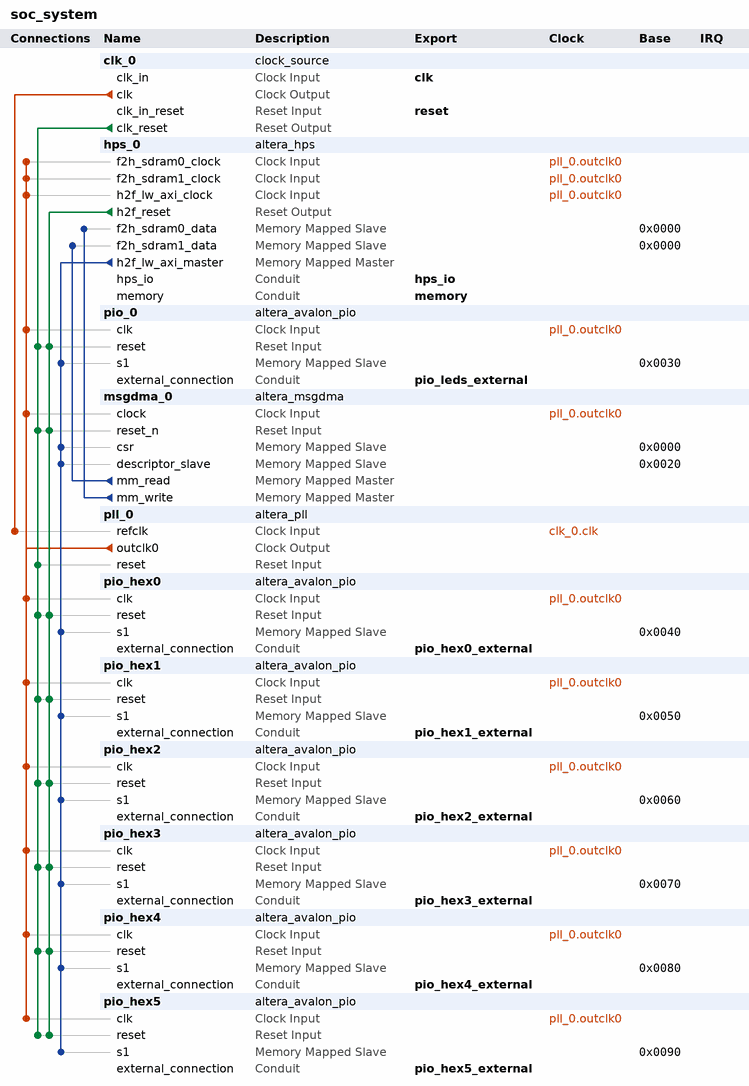
[diagram p0: system contents]
# Platform Designer (Qsys) system soc_system, Cyclone V 5CSXFC6D6F31C6
# Parameters at their usual value, and those the tool derives, are not listed.
package require -exact qsys 18.1
create_system soc_system
set_project_property DEVICE_FAMILY {Cyclone V}
set_project_property DEVICE 5CSXFC6D6F31C6

add_instance clk_0 clock_source 18.1
set_instance_parameter_value clk_0 clockFrequency 50000000

add_instance hps_0 altera_hps 18.1
set_instance_parameter_value hps_0 EMAC1_Mode RGMII
set_instance_parameter_value hps_0 EMAC1_PinMuxing {HPS I/O Set 0}
set_instance_parameter_value hps_0 F2SCLK_COLDRST_Enable false
set_instance_parameter_value hps_0 F2SCLK_DBGRST_Enable false
set_instance_parameter_value hps_0 F2SCLK_WARMRST_Enable false
set_instance_parameter_value hps_0 F2SDRAM_Type {Avalon-MM Write-Only,Avalon-MM Read-Only}
set_instance_parameter_value hps_0 F2SDRAM_Width 256,256
set_instance_parameter_value hps_0 F2SINTERRUPT_Enable false
set_instance_parameter_value hps_0 F2S_Width 0
set_instance_parameter_value hps_0 FPGA_PERIPHERAL_OUTPUT_CLOCK_FREQ_EMAC0_GTX_CLK 125
set_instance_parameter_value hps_0 FPGA_PERIPHERAL_OUTPUT_CLOCK_FREQ_EMAC0_MD_CLK 2.5
set_instance_parameter_value hps_0 FPGA_PERIPHERAL_OUTPUT_CLOCK_FREQ_EMAC1_GTX_CLK 125
set_instance_parameter_value hps_0 FPGA_PERIPHERAL_OUTPUT_CLOCK_FREQ_EMAC1_MD_CLK 2.5
set_instance_parameter_value hps_0 HPS_PROTOCOL DDR3
set_instance_parameter_value hps_0 I2C0_Mode I2C
set_instance_parameter_value hps_0 I2C0_PinMuxing {HPS I/O Set 0}
set_instance_parameter_value hps_0 I2C1_Mode I2C
set_instance_parameter_value hps_0 I2C1_PinMuxing {HPS I/O Set 0}
set_instance_parameter_value hps_0 LWH2F_Enable true
set_instance_parameter_value hps_0 MEM_BANKADDR_WIDTH 3
set_instance_parameter_value hps_0 MEM_CLK_FREQ 400.0
set_instance_parameter_value hps_0 MEM_COL_ADDR_WIDTH 10
set_instance_parameter_value hps_0 MEM_DQ_WIDTH 32
set_instance_parameter_value hps_0 MEM_DRV_STR RZQ/6
set_instance_parameter_value hps_0 MEM_ROW_ADDR_WIDTH 15
set_instance_parameter_value hps_0 MEM_RTT_NOM RZQ/6
set_instance_parameter_value hps_0 MEM_RTT_WR {Dynamic ODT off}
set_instance_parameter_value hps_0 MEM_TCL 11
set_instance_parameter_value hps_0 MEM_TFAW_NS 45.0
set_instance_parameter_value hps_0 MEM_TRAS_NS 35.0
set_instance_parameter_value hps_0 MEM_TRCD_NS 13.75
set_instance_parameter_value hps_0 MEM_TRFC_NS 260.0
set_instance_parameter_value hps_0 MEM_TRP_NS 13.75
set_instance_parameter_value hps_0 MEM_VENDOR Micron
set_instance_parameter_value hps_0 MEM_WTCL 7
set_instance_parameter_value hps_0 QSPI_Mode {1 SS}
set_instance_parameter_value hps_0 QSPI_PinMuxing {HPS I/O Set 0}
set_instance_parameter_value hps_0 REF_CLK_FREQ 25.0
set_instance_parameter_value hps_0 S2FCLK_USER2CLK 5
set_instance_parameter_value hps_0 S2F_Width 0
set_instance_parameter_value hps_0 SDIO_Mode {4-bit Data}
set_instance_parameter_value hps_0 SDIO_PinMuxing {HPS I/O Set 0}
set_instance_parameter_value hps_0 SPIM1_Mode {Single Slave Select}
set_instance_parameter_value hps_0 SPIM1_PinMuxing {HPS I/O Set 0}
set_instance_parameter_value hps_0 STM_Enable false
set_instance_parameter_value hps_0 TIMING_BOARD_AC_SKEW 0.02
set_instance_parameter_value hps_0 TIMING_BOARD_AC_TO_CK_SKEW 0.01
set_instance_parameter_value hps_0 TIMING_BOARD_DQ_TO_DQS_SKEW 0.05
set_instance_parameter_value hps_0 TIMING_BOARD_MAX_CK_DELAY 0.03
set_instance_parameter_value hps_0 TIMING_BOARD_MAX_DQS_DELAY 0.02
set_instance_parameter_value hps_0 TIMING_BOARD_SKEW_BETWEEN_DQS 0.06
set_instance_parameter_value hps_0 TIMING_BOARD_SKEW_CKDQS_DIMM_MAX 0.12
set_instance_parameter_value hps_0 TIMING_BOARD_SKEW_CKDQS_DIMM_MIN 0.06
set_instance_parameter_value hps_0 TIMING_BOARD_SKEW_WITHIN_DQS 0.01
set_instance_parameter_value hps_0 TIMING_TDH 65
set_instance_parameter_value hps_0 TIMING_TDQSCK 255
set_instance_parameter_value hps_0 TIMING_TDQSQ 125
set_instance_parameter_value hps_0 TIMING_TDS 30
set_instance_parameter_value hps_0 TIMING_TIH 140
set_instance_parameter_value hps_0 TIMING_TIS 190
set_instance_parameter_value hps_0 TIMING_TQSH 0.4
set_instance_parameter_value hps_0 UART0_Mode {No Flow Control}
set_instance_parameter_value hps_0 UART0_PinMuxing {HPS I/O Set 0}
set_instance_parameter_value hps_0 USB1_Mode SDR
set_instance_parameter_value hps_0 USB1_PinMuxing {HPS I/O Set 0}
set_instance_parameter_value hps_0 desired_cfg_clk_mhz 100.0
set_instance_parameter_value hps_0 desired_qspi_clk_mhz 400.0

add_instance pio_0 altera_avalon_pio 18.1
set_instance_parameter_value pio_0 direction Output
set_instance_parameter_value pio_0 resetValue 170
set_instance_parameter_value pio_0 width 10

add_instance msgdma_0 altera_msgdma 18.1
set_instance_parameter_value msgdma_0 BURST_ENABLE 1
set_instance_parameter_value msgdma_0 DATA_FIFO_DEPTH 1024
set_instance_parameter_value msgdma_0 DATA_WIDTH 256
set_instance_parameter_value msgdma_0 DESCRIPTOR_FIFO_DEPTH 128
set_instance_parameter_value msgdma_0 ENHANCED_FEATURES 0
set_instance_parameter_value msgdma_0 ERROR_ENABLE 0
set_instance_parameter_value msgdma_0 MAX_BURST_COUNT 16
set_instance_parameter_value msgdma_0 MAX_BYTE 368435456
set_instance_parameter_value msgdma_0 MODE 0
set_instance_parameter_value msgdma_0 PACKET_ENABLE 0
set_instance_parameter_value msgdma_0 TRANSFER_TYPE {Aligned Accesses}

add_instance pll_0 altera_pll 18.1
set_instance_parameter_value pll_0 gui_device_speed_grade 1
set_instance_parameter_value pll_0 gui_number_of_clocks 1
set_instance_parameter_value pll_0 gui_operation_mode normal
set_instance_parameter_value pll_0 gui_output_clock_frequency0 100.0
set_instance_parameter_value pll_0 gui_pll_mode {Integer-N PLL}
set_instance_parameter_value pll_0 gui_reference_clock_frequency 50.0
set_instance_parameter_value pll_0 gui_use_locked false

add_instance pio_hex0 altera_avalon_pio 18.1
set_instance_parameter_value pio_hex0 direction Output
set_instance_parameter_value pio_hex0 resetValue 127
set_instance_parameter_value pio_hex0 width 7

add_instance pio_hex1 altera_avalon_pio 18.1
set_instance_parameter_value pio_hex1 direction Output
set_instance_parameter_value pio_hex1 resetValue 127
set_instance_parameter_value pio_hex1 width 7

add_instance pio_hex2 altera_avalon_pio 18.1
set_instance_parameter_value pio_hex2 direction Output
set_instance_parameter_value pio_hex2 resetValue 127
set_instance_parameter_value pio_hex2 width 7

add_instance pio_hex3 altera_avalon_pio 18.1
set_instance_parameter_value pio_hex3 direction Output
set_instance_parameter_value pio_hex3 resetValue 127
set_instance_parameter_value pio_hex3 width 7

add_instance pio_hex4 altera_avalon_pio 18.1
set_instance_parameter_value pio_hex4 direction Output
set_instance_parameter_value pio_hex4 resetValue 127
set_instance_parameter_value pio_hex4 width 7

add_instance pio_hex5 altera_avalon_pio 18.1
set_instance_parameter_value pio_hex5 direction Output
set_instance_parameter_value pio_hex5 resetValue 127
set_instance_parameter_value pio_hex5 width 7

# connections
add_connection clk_0.clk pll_0.refclk clock
add_connection pll_0.outclk0 hps_0.f2h_sdram0_clock clock
add_connection pll_0.outclk0 hps_0.f2h_sdram1_clock clock
add_connection pll_0.outclk0 hps_0.h2f_lw_axi_clock clock
add_connection pll_0.outclk0 msgdma_0.clock clock
add_connection pll_0.outclk0 pio_0.clk clock
add_connection pll_0.outclk0 pio_hex0.clk clock
add_connection pll_0.outclk0 pio_hex1.clk clock
add_connection pll_0.outclk0 pio_hex2.clk clock
add_connection pll_0.outclk0 pio_hex3.clk clock
add_connection pll_0.outclk0 pio_hex4.clk clock
add_connection pll_0.outclk0 pio_hex5.clk clock
add_connection clk_0.clk_reset msgdma_0.reset_n reset
add_connection clk_0.clk_reset pio_0.reset reset
add_connection clk_0.clk_reset pio_hex0.reset reset
add_connection clk_0.clk_reset pio_hex1.reset reset
add_connection clk_0.clk_reset pio_hex2.reset reset
add_connection clk_0.clk_reset pio_hex3.reset reset
add_connection clk_0.clk_reset pio_hex4.reset reset
add_connection clk_0.clk_reset pio_hex5.reset reset
add_connection clk_0.clk_reset pll_0.reset reset
add_connection hps_0.h2f_reset msgdma_0.reset_n reset
add_connection hps_0.h2f_reset pio_0.reset reset
add_connection hps_0.h2f_reset pio_hex0.reset reset
add_connection hps_0.h2f_reset pio_hex1.reset reset
add_connection hps_0.h2f_reset pio_hex2.reset reset
add_connection hps_0.h2f_reset pio_hex3.reset reset
add_connection hps_0.h2f_reset pio_hex4.reset reset
add_connection hps_0.h2f_reset pio_hex5.reset reset
add_connection hps_0.h2f_lw_axi_master msgdma_0.csr avalon
set_connection_parameter_value hps_0.h2f_lw_axi_master/msgdma_0.csr baseAddress 0x0000
add_connection hps_0.h2f_lw_axi_master msgdma_0.descriptor_slave avalon
set_connection_parameter_value hps_0.h2f_lw_axi_master/msgdma_0.descriptor_slave baseAddress 0x0020
add_connection hps_0.h2f_lw_axi_master pio_0.s1 avalon
set_connection_parameter_value hps_0.h2f_lw_axi_master/pio_0.s1 baseAddress 0x0030
add_connection hps_0.h2f_lw_axi_master pio_hex0.s1 avalon
set_connection_parameter_value hps_0.h2f_lw_axi_master/pio_hex0.s1 baseAddress 0x0040
add_connection hps_0.h2f_lw_axi_master pio_hex1.s1 avalon
set_connection_parameter_value hps_0.h2f_lw_axi_master/pio_hex1.s1 baseAddress 0x0050
add_connection hps_0.h2f_lw_axi_master pio_hex2.s1 avalon
set_connection_parameter_value hps_0.h2f_lw_axi_master/pio_hex2.s1 baseAddress 0x0060
add_connection hps_0.h2f_lw_axi_master pio_hex3.s1 avalon
set_connection_parameter_value hps_0.h2f_lw_axi_master/pio_hex3.s1 baseAddress 0x0070
add_connection hps_0.h2f_lw_axi_master pio_hex4.s1 avalon
set_connection_parameter_value hps_0.h2f_lw_axi_master/pio_hex4.s1 baseAddress 0x0080
add_connection hps_0.h2f_lw_axi_master pio_hex5.s1 avalon
set_connection_parameter_value hps_0.h2f_lw_axi_master/pio_hex5.s1 baseAddress 0x0090
add_connection msgdma_0.mm_read hps_0.f2h_sdram1_data avalon
set_connection_parameter_value msgdma_0.mm_read/hps_0.f2h_sdram1_data baseAddress 0x0000
add_connection msgdma_0.mm_write hps_0.f2h_sdram0_data avalon
set_connection_parameter_value msgdma_0.mm_write/hps_0.f2h_sdram0_data baseAddress 0x0000

# exported interfaces
add_interface clk clock sink
set_interface_property clk EXPORT_OF clk_0.clk_in
add_interface hps_io conduit end
set_interface_property hps_io EXPORT_OF hps_0.hps_io
add_interface memory conduit end
set_interface_property memory EXPORT_OF hps_0.memory
add_interface pio_leds_external conduit end
set_interface_property pio_leds_external EXPORT_OF pio_0.external_connection
add_interface pio_hex0_external conduit end
set_interface_property pio_hex0_external EXPORT_OF pio_hex0.external_connection
add_interface pio_hex1_external conduit end
set_interface_property pio_hex1_external EXPORT_OF pio_hex1.external_connection
add_interface pio_hex2_external conduit end
set_interface_property pio_hex2_external EXPORT_OF pio_hex2.external_connection
add_interface pio_hex3_external conduit end
set_interface_property pio_hex3_external EXPORT_OF pio_hex3.external_connection
add_interface pio_hex4_external conduit end
set_interface_property pio_hex4_external EXPORT_OF pio_hex4.external_connection
add_interface pio_hex5_external conduit end
set_interface_property pio_hex5_external EXPORT_OF pio_hex5.external_connection
add_interface reset reset sink
set_interface_property reset EXPORT_OF clk_0.clk_in_reset

set_interconnect_requirement {$system} qsys_mm.clockCrossingAdapter HANDSHAKE
set_interconnect_requirement {$system} qsys_mm.enableEccProtection FALSE
set_interconnect_requirement {$system} qsys_mm.insertDefaultSlave FALSE
set_interconnect_requirement {$system} qsys_mm.maxAdditionalLatency 1

save_system soc_system.qsys
